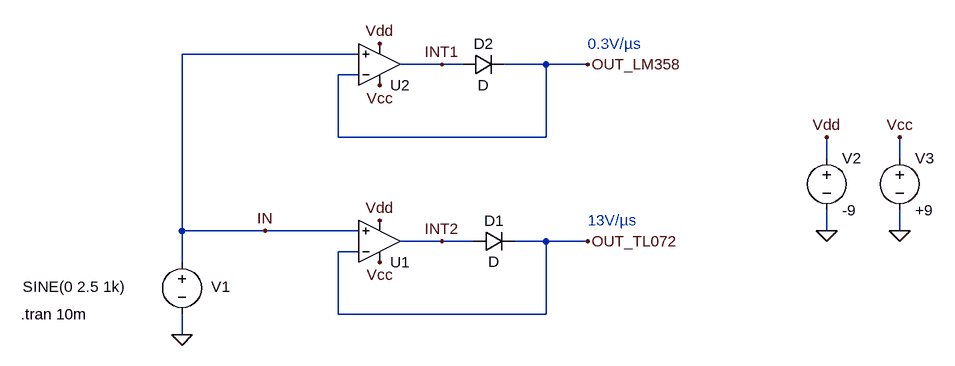
[diagram p0: schematic diode_follower.asc]
diode_follower.asc, the LTspice schematic file:
Version 4
SHEET 1 1052 680
WIRE 160 -128 -112 -128
WIRE 288 -112 224 -112
WIRE 320 -112 288 -112
WIRE 448 -112 384 -112
WIRE 512 -112 448 -112
WIRE 160 -96 128 -96
WIRE 128 0 128 -96
WIRE 448 0 448 -112
WIRE 448 0 128 0
WIRE 880 32 880 0
WIRE 992 32 992 0
WIRE -112 144 -112 -128
WIRE 16 144 -112 144
WIRE 160 144 16 144
WIRE 880 144 880 112
WIRE 992 144 992 112
WIRE 288 160 224 160
WIRE 336 160 288 160
WIRE 448 160 400 160
WIRE 512 160 448 160
WIRE 160 176 128 176
WIRE -112 192 -112 144
WIRE 128 272 128 176
WIRE 448 272 448 160
WIRE 448 272 128 272
WIRE -112 304 -112 272
FLAG -112 304 0
FLAG 880 144 0
FLAG 992 144 0
FLAG 992 0 Vcc
FLAG 880 0 Vdd
FLAG 16 144 IN
FLAG 192 128 Vdd
FLAG 192 192 Vcc
FLAG 512 160 OUT_TL072
FLAG 512 -112 OUT_LM358
FLAG 288 160 INT2
FLAG 192 -80 Vcc
FLAG 192 -144 Vdd
FLAG 288 -112 INT1
SYMBOL voltage -112 176 R0
WINDOW 0 45 54 Left 2
WINDOW 3 -245 54 Left 2
WINDOW 123 0 0 Left 0
WINDOW 39 0 0 Left 0
SYMATTR InstName V1
SYMATTR Value SINE(0 2.5 1k)
SYMBOL voltage 880 16 R0
WINDOW 123 0 0 Left 0
WINDOW 39 0 0 Left 0
SYMATTR InstName V2
SYMATTR Value -9
SYMBOL voltage 992 16 R0
WINDOW 123 0 0 Left 0
WINDOW 39 0 0 Left 0
SYMATTR InstName V3
SYMATTR Value +9
SYMBOL OpAmps\\UniversalOpAmp2 192 160 M180
SYMATTR InstName U1
SYMATTR Value2 Avol=1Meg GBW=10Meg Slew=13Meg
SYMBOL diode 336 176 R270
WINDOW 0 32 32 VTop 2
WINDOW 3 0 32 VBottom 2
SYMATTR InstName D1
SYMBOL OpAmps\\UniversalOpAmp2 192 -112 M180
SYMATTR InstName U2
SYMATTR Value2 Avol=1Meg GBW=10Meg Slew=0.3Meg
SYMBOL diode 320 -96 R270
WINDOW 0 32 32 VTop 2
WINDOW 3 0 32 VBottom 2
SYMATTR InstName D2
TEXT -360 272 Left 2 !.tran 10m
TEXT 512 -144 Left 2 ;0.3V/µs
TEXT 512 128 Left 2 ;13V/µs

The netlist it stands for:
* diode_follower.asc
V1 IN 0 SINE(0 2.5 1k)
V2 Vdd 0 -9
V3 Vcc 0 +9
XU1 IN OUT_TL072 Vcc Vdd INT2 level2 Avol=1Meg GBW=10Meg Slew=13Meg Ilimit=25m Rail=0 Vos=0 En=0 Enk=0 In=0 Ink=0 Rin=500Meg  ; pins In+ In- V+ V- OUT
D1 INT2 OUT_TL072 D
XU2 IN OUT_LM358 Vcc Vdd INT1 level2 Avol=1Meg GBW=10Meg Slew=0.3Meg Ilimit=25m Rail=0 Vos=0 En=0 Enk=0 In=0 Ink=0 Rin=500Meg  ; pins In+ In- V+ V- OUT
D2 INT1 OUT_LM358 D
.model D D
.lib standard.dio
.tran 10m
* 0.3V/µs
* 13V/µs
.lib UniversalOpAmp2.lib
.backanno
.end

* Results of the author's LTspice run, read from the files saved beside the schematic
* Operating Point, zero values left out:
*   V(vdd) = -9 V
*   V(vcc) = 9 V
*   I(V2) = 1.799 mA
*   I(V3) = -1.799 mA
*   Ix(u1:3) = 899.7 µA
*   Ix(u1:4) = -899.7 µA
*   Ix(u2:3) = 899.7 µA
*   Ix(u2:4) = -899.7 µA
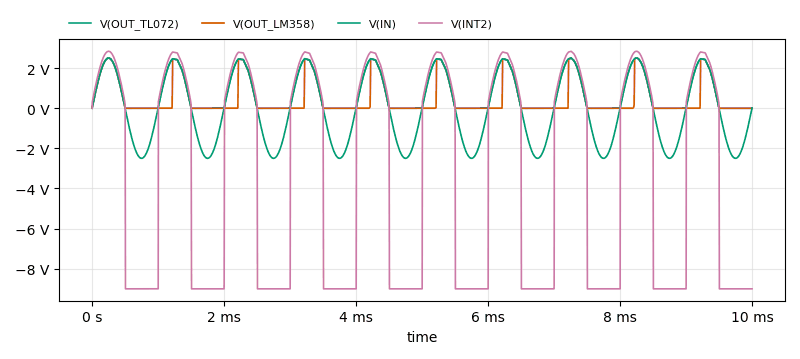
[diagram p1: Transient Analysis of diode_follower.asc, plotted from the saved traces]
* Transient Analysis, 1 run:
*   V(OUT_TL072): min -4.503 mV, max 2.497 V, average 788.2 mV, rms 1.243 V, last -4.503 mV
*   V(OUT_LM358): min -4.503 mV, max 2.497 V, average 504.2 mV, rms 1.009 V, last -4.503 mV
*   V(IN): min -2.499 V, max 2.5 V, average -3.599 mV, rms 1.763 V, last 0 V
*   V(INT2): min -9 V, max 2.837 V, average -3.553 V, rms 6.524 V, last -9 V